# Altium schematic sheet Power.SchDoc
size A4; SheetNumber: 2; SheetTotal: 3
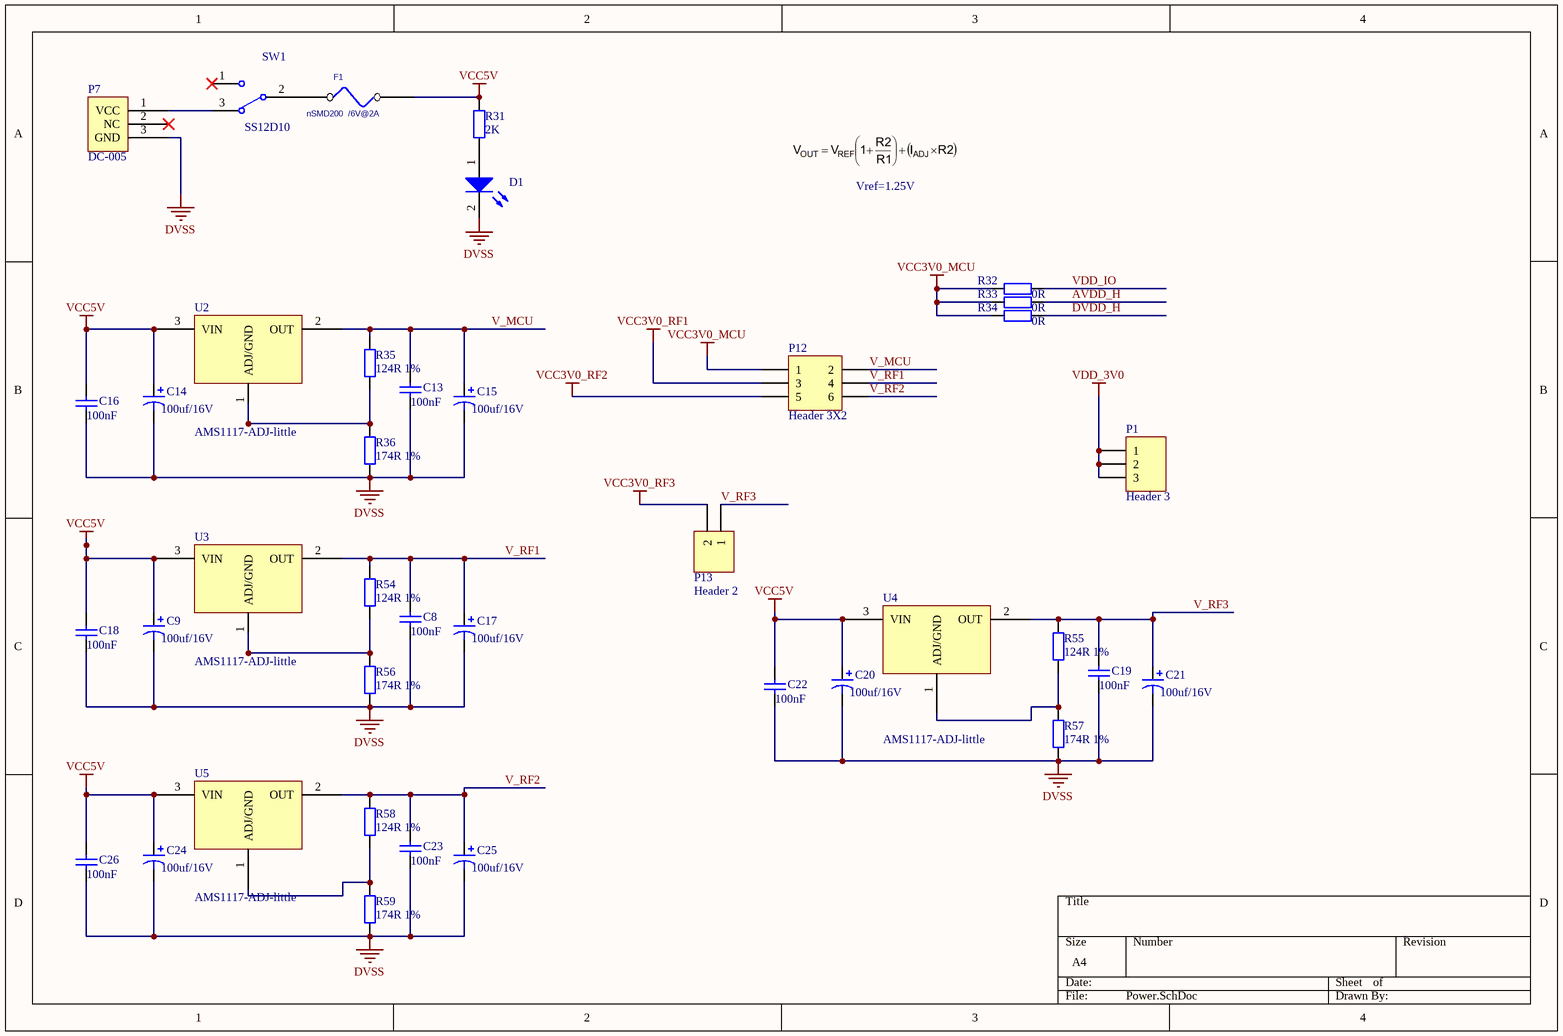
[diagram p0: Power.SchDoc]

## Parts
C8  100nF  [R0603]
C9  100uf/16V  [TAN3528]
C13  100nF  [R0603]
C14  100uf/16V  [TAN3528]
C15  100uf/16V  [TAN3528]
C16  100nF  [R0603]
C17  100uf/16V  [TAN3528]
C18  100nF  [R0603]
C19  100nF  [R0603]
C20  100uf/16V  [TAN3528]
C21  100uf/16V  [TAN3528]
C22  100nF  [R0603]
C23  100nF  [R0603]
C24  100uf/16V  [TAN3528]
C25  100uf/16V  [TAN3528]
C26  100nF  [R0603]
D1  LED_Red  [0603d]  (value not drawn)
F1  nSMD200  /6V@2A  [FN1812]
P1  Header 3  [HDR1X3]
P7  DC-005  [DC005]
P12  Header 3X2  [HDR2X3]
P13  Header 2  [HDR1X2]
R31  2K  [R0603]
R32  0R  [R0603]
R33  0R  [R0603]
R34  0R  [R0603]
R35  124R 1%  [R0603]
R36  174R 1%  [R0603]
R54  124R 1%  [R0603]
R55  124R 1%  [R0603]
R56  174R 1%  [R0603]
R57  174R 1%  [R0603]
R58  124R 1%  [R0603]
R59  174R 1%  [R0603]
SW1  SS12D10  [SW123]
U2  AMS1117-ADJ-little  [LDO-SOT-89-3]
U3  AMS1117-ADJ-little  [LDO-SOT-89-3]
U4  AMS1117-ADJ-little  [LDO-SOT-89-3]
U5  AMS1117-ADJ-little  [LDO-SOT-89-3]

## Nets
DVSS: C8.1 C9.2 C13.1 C14.2 C15.2 C16.1 C17.2 C18.1 C19.1 C20.2 C21.2 C22.1 C23.1 C24.2 C25.2 C26.1 D1.2(K) P7.3(GND) R36.1 R56.1 R57.1 R59.1
VCC3V0_MCU: P12.1 R32.1 R33.1 R34.1
VCC3V0_RF1: P12.3
VCC3V0_RF2: P12.5
VCC3V0_RF3: P13.2
VCC5V: C9.1 C14.1 C16.2 C18.2 C20.1 C22.2 C24.1 C26.2 F1.2 R31.1 U2.3(VIN) U3.3(VIN) U4.3(VIN) U5.3(VIN)
VDD_3V0: P1.1 P1.2 P1.3
AVDD_H: R33.2
DVDD_H: R34.2
V_MCU: C13.2 C15.1 P12.2 R35.2 U2.2(OUT)
V_RF1: C8.2 C17.1 P12.4 R54.2 U3.2(OUT)
V_RF2: C23.2 C25.1 P12.6 R58.2 U5.2(OUT)
V_RF3: C19.2 C21.1 P13.1 R55.2 U4.2(OUT)
VDD_IO: R32.2
NetD1_1: D1.1(A) R31.2
NetF1_1: F1.1 SW1.2
NetP7_1: P7.1(VCC) SW1.3
NetR35_1: R35.1 R36.2 U2.1(ADJ/GND)
NetR54_1: R54.1 R56.2 U3.1(ADJ/GND)
NetR55_1: R55.1 R57.2 U4.1(ADJ/GND)
NetR58_1: R58.1 R59.2 U5.1(ADJ/GND)

Not connected (* = marked no-connect by the designer): P7 2(NC)*; SW1 1*

## Notes on the sheet
- Vref=1.25V

## Library data of the parts
C8 C13 C16 C18 C19 C22 C23 C26 = Cap: Value: 100pF; Published: 8-Jun-2000; LatestRevisionDate: 17-Jul-2002; LatestRevisionNote: Re-released for DXP Platform.; PackageReference: RAD-0.3; Publisher: Altium Limited
C9 C14 C15 C17 C20 C21 C24 C25 = Cap Pol1: tan3528 100uf/16V; Value: 100pF; Published: 8-Jun-2000; LatestRevisionDate: 17-Jul-2002; LatestRevisionNote: Re-released for DXP Platform.; PackageReference: RB7.6-15; Publisher: Altium Limited; PackageDescription: Polarized Capacitor (Radial); 2 Leads
D1 = LED2: Typical RED, GREEN, YELLOW, AMBER GaAs LED; Manufacturer: Generic Components; Class: Optoelectronic; Published: 08/06/2000; Publisher: Altium Hobart Technology Centre; SubClass: LED
F1 = FUSE: MFR_PN: 0603L100SLYR; MFR_Name: LITTELFUSE
P1 = Header 3: Header, 3-Pin; LatestRevisionDate: 17-Jul-2002; LatestRevisionNote: Re-released for DXP Platform.; Publisher: Altium Limited
P13 = Header 2: 2.54mm直插针,2P; LatestRevisionDate: 17-Jul-2002; LatestRevisionNote: Re-released for DXP Platform.; Publisher: Altium Limited
R31-R34 = Res2: Resistor; Manufacturer: Generic Components; Class: Passive; Value: 2.2K; Published: 08/06/2000; Publisher: Altium Hobart Technology Centre; SubClass: Resistor
R35 R36 R54-R59 = Res2: Value: 1K; Published: 8-Jun-2000; LatestRevisionDate: 17-Jul-2002; LatestRevisionNote: Re-released for DXP Platform.; PackageReference: AXIAL-0.4; Publisher: Altium Limited; PackageDescription: Axial Device, Thru-Hole; 2 Leads; 0.4 in Pin Spacing
SW1 = SW123
U2 = AMS1117-ADJ-little: AMS1117-ADJ-little ,SOT-89-3
U3-U5 = AMS1117-ADJ-little: AMS1117-ADJ-little,SOT-89-3